# Altium schematic sheet esp-plane-s.SchDoc
size A4; SheetNumber: 1; SheetTotal: 1; SPICEModelCacheZWEIZCEH: <root> / <DocumentId>ZWEIZCEH</DocumentId> / <CacheFrame Number="0"> / <Model Name="skydiode" Kind="MDL"> / <Text>*Default Schottky Diode / *Schottky Diode Pinout: A,K / .MODEL SKYDIODE D(EG=0.69 XTI=2)</Text> / </Model> / </CacheFrame> / </root>
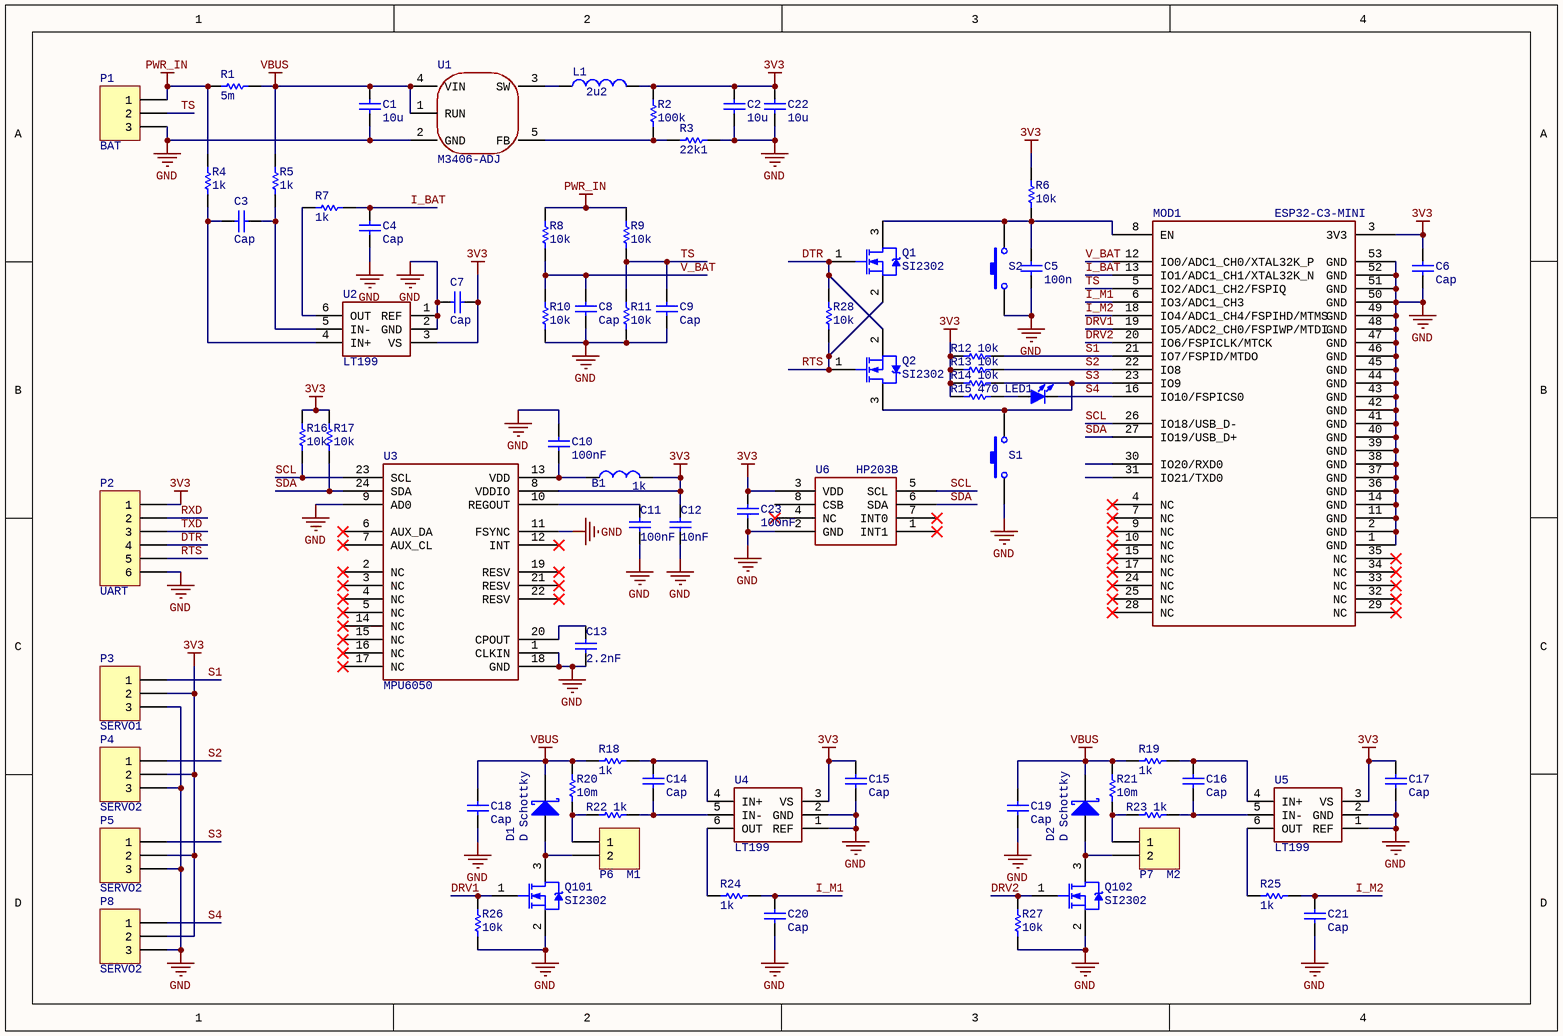
[diagram p0: esp-plane-s.SchDoc]

## Parts
B1  value 1k  [RESC100X50X35L25N]  (hidden comment: BEAD-470-100MHZ-1A-0603-BLM18PG471SN1)
C1  value 10u  [CAPC160X80X90L30N]  (hidden comment: Capacitor)
C2  value 10u  [CAPC160X80X90L30N]  (hidden comment: Capacitor)
C3  Cap  [CAPC100X50X55L25N]
C4  Cap  [CAPC100X50X55L25N]
C5  value 100n  [CAPC100X50X55L25N]  (hidden comment: Capacitor)
C6  Cap  [CAPC100X50X55L25N]
C7  Cap  [CAPC100X50X55L25N]
C8  Cap  [CAPC100X50X55L25N]
C9  Cap  [CAPC100X50X55L25N]
C10  100nF  [CAPC100X50X55L25N]
C11  100nF  [CAPC100X50X55L25N]
C12  10nF  [CAPC100X50X55L25N]
C13  2.2nF  [CAPC100X50X55L25N]
C14  Cap  [CAPC100X50X55L25N]
C15  Cap  [CAPC100X50X55L25N]
C16  Cap  [CAPC100X50X55L25N]
C17  Cap  [CAPC100X50X55L25N]
C18  Cap  [CAPC160X80X90L30N]
C19  Cap  [CAPC160X80X90L30N]
C20  Cap  [CAPC100X50X55L25N]
C21  Cap  [CAPC100X50X55L25N]
C22  value 10u  [CAPC160X80X90L30N]  (hidden comment: Capacitor)
C23  100nF  [CAPC100X50X55L25N]
D1  D Schottky  [SOD-523]
D2  D Schottky  [SOD-523]
L1  value 2u2  [INDC200X160X105L60N]  (hidden comment: Inductor)
LED1  蓝灯 正贴  [LEDC100X50X45L25N]  (value not drawn)
MOD1  ESP32-C3-MINI  [ESP32-C3-MINI-1U]
P1  BAT  [BC-1-319]
P2  UART  [HDR1X6]
P3  SERVO1  [FPC-SMD_3P-P1.25_DEALON_1.25-3PS-1]
P4  SERVO2  [FPC-SMD_3P-P1.25_DEALON_1.25-3PS-1]
P5  SERVO2  [FPC-SMD_3P-P1.25_DEALON_1.25-3PS-1]
P6  M1  [CONN-SMD_2P-P1.25_DEALON_1.25-2PS]
P7  M2  [CONN-SMD_2P-P1.25_DEALON_1.25-2PS]
P8  SERVO2  [FPC-SMD_3P-P1.25_DEALON_1.25-3PS-1]
Q1  SI2302  [SOT23-3P95_237X111L52X43N]
Q2  SI2302  [SOT23-3P95_237X111L52X43N]
Q101  SI2302  [SOT23-3P95_237X111L52X43N]
Q102  SI2302  [SOT23-3P95_237X111L52X43N]
R1  5m  [RES 0603/1608]
R2  value 100k  [RESC100X50X35L25N]  (hidden comment: Resistor)
R3  value 22k1  [RESC100X50X35L25N]  (hidden comment: Resistor)
R4  1k  [RESC100X50X35L25N]
R5  1k  [RESC100X50X35L25N]
R6  value 10k  [RESC100X50X35L25N]  (hidden comment: Resistor)
R7  1k  [RESC100X50X35L25N]
R8  10k  [RESC100X50X35L25N]
R9  10k  [RESC100X50X35L25N]
R10  10k  [RESC100X50X35L25N]
R11  10k  [RESC100X50X35L25N]
R12  value 10k  [RESC100X50X35L25N]  (hidden comment: Resistor)
R13  value 10k  [RESC100X50X35L25N]  (hidden comment: Resistor)
R14  value 10k  [RESC100X50X35L25N]  (hidden comment: Resistor)
R15  value 470  [RESC100X50X35L25N]  (hidden comment: Resistor)
R16  10k  [RESC100X50X35L25N]
R17  10k  [RESC100X50X35L25N]
R18  1k  [RESC100X50X35L25N]
R19  1k  [RESC100X50X35L25N]
R20  10m  [RES 0603/1608]
R21  10m  [RES 0603/1608]
R22  1k  [RESC100X50X35L25N]
R23  1k  [RESC100X50X35L25N]
R24  1k  [RESC100X50X35L25N]
R25  1k  [RESC100X50X35L25N]
R26  10k  [RESC100X50X35L25N]
R27  10k  [RESC100X50X35L25N]
R28  value 10k  [RESC100X50X35L25N]  (hidden comment: Resistor)
S1  KEY  [KEY-3*4]  (value not drawn)
S2  KEY  [KEY-3*4]  (value not drawn)
U1  M3406-ADJ  [SOT23-5P95_280X110L37X40N]
U2  LT199  [SC-70-6_L2.0-W1.3-P0.65-LS2.2-BL]
U3  MPU6050  [IMU-3000]
U4  LT199  [SC-70-6_L2.0-W1.3-P0.65-LS2.2-BL]
U5  LT199  [SC-70-6_L2.0-W1.3-P0.65-LS2.2-BL]
U6  HP203B  [HP203B]

## Nets
3V3: B1.2 C2.2 C6.2 C7.1 C12.1 C15.2 C17.2 C22.2 C23.1 L1.2 MOD1.3(3V3) P2.1 P3.2 P4.2 P5.2 P8.2 R2.2 R6.2 R12.1 R13.1 R14.1 R15.1 R16.2 R17.2 U2.3(VS) U3.8(VDDIO) U4.3(VS) U5.3(VS) U6.3(VDD)
GND: C1.1 C2.1 C4.1 C5.1 C6.1 C7.2 C8.2 C9.2 C10.1 C11.1 C12.2 C13.1 C15.1 C17.1 C18.1 C19.1 C20.1 C21.1 C22.1 C23.2 MOD1.1(GND) MOD1.2(GND) MOD1.11(GND) MOD1.14(GND) MOD1.36(GND) MOD1.37(GND) MOD1.38(GND) MOD1.39(GND) MOD1.40(GND) MOD1.41(GND) MOD1.42(GND) MOD1.43(GND) MOD1.44(GND) MOD1.45(GND) MOD1.46(GND) MOD1.47(GND) MOD1.48(GND) MOD1.49(GND) MOD1.50(GND) MOD1.51(GND) MOD1.52(GND) MOD1.53(GND) P1.3 P2.6 P3.3 P4.3 P5.3 P8.3 Q101.2(S) Q102.2(S) R3.1 R10.1 R11.1 R26.1 R27.1 S1.2 S2.2 U1.2(GND) U2.1(REF) U2.2(GND) U3.1(CLKIN) U3.9(AD0) U3.11(FSYNC) U3.18(GND) U4.1(REF) U4.2(GND) U5.1(REF) U5.2(GND) U6.2(GND)
PWR_IN: P1.1 R1.2 R4.1 R8.2 R9.2
VBUS: C1.2 C18.2 C19.2 D1.2(K) D2.2(K) R1.1 R5.1 R18.1 R19.1 R20.2 R21.2 U1.1(RUN) U1.4(VIN)
DRV1: MOD1.19(IO5/ADC2_CH0/FSPIWP/MTDI) Q101.1(G) R26.2
DRV2: MOD1.20(IO6/FSPICLK/MTCK) Q102.1(G) R27.2
DTR: P2.4 Q1.1(G) Q2.2(S) R28.2
I_BAT: C4.2 MOD1.13(IO1/ADC1_CH1/XTAL32K_N) R7.2
I_M1: C20.2 MOD1.6(IO3/ADC1_CH3) R24.2
I_M2: C21.2 MOD1.18(IO4/ADC1_CH4/FSPIHD/MTMS) R25.2
RTS: P2.5 Q1.2(S) Q2.1(G) R28.1
RXD: P2.2
S1: MOD1.21(IO7/FSPID/MTDO) P3.1 R12.2
S2: MOD1.22(IO8) P4.1 R13.2
S3: MOD1.23(IO9) P5.1 Q2.3(D) R14.2 S1.1
S4: LED1.C(K) MOD1.16(IO10/FSPICS0) P8.1
SCL: MOD1.26(IO18/USB_D-) R16.1 U3.23(SCL) U6.5(SCL)
SDA: MOD1.27(IO19/USB_D+) R17.1 U3.24(SDA) U6.6(SDA)
TS: C9.1 MOD1.5(IO2/ADC1_CH2/FSPIQ) P1.2 R9.1 R11.2
TXD: P2.3
V_BAT: C8.1 MOD1.12(IO0/ADC1_CH0/XTAL32K_P) R8.1 R10.2
NetB1_1: B1.1 C10.2 U3.13(VDD)
NetC3_1: C3.1 R4.2 U2.4(IN+)
NetC3_2: C3.2 R5.2 U2.5(IN-)
NetC5_2: C5.2 MOD1.8(EN) Q1.3(D) R6.1 S2.1
NetC11_2: C11.2 U3.10(REGOUT)
NetC13_2: C13.2 U3.20(CPOUT)
NetC14_1: C14.1 R22.2 U4.5(IN-)
NetC14_2: C14.2 R18.2 U4.4(IN+)
NetC16_1: C16.1 R23.2 U5.5(IN-)
NetC16_2: C16.2 R19.2 U5.4(IN+)
NetD1_1: D1.1(A) P6.2 Q101.3(D)
NetD2_1: D2.1(A) P7.2 Q102.3(D)
NetL1_1: L1.1 U1.3(SW)
NetLED1_A: LED1.A R15.2
NetP6_1: P6.1 R20.1 R22.1
NetP7_1: P7.1 R21.1 R23.1
NetR2_1: R2.1 R3.2 U1.5(FB)
NetR7_1: R7.1 U2.6(OUT)
NetR24_1: R24.1 U4.6(OUT)
NetR25_1: R25.1 U5.6(OUT)

Not connected (* = marked no-connect by the designer): MOD1 4(NC)* 7(NC)* 9(NC)* 10(NC)* 15(NC)* 17(NC)* 24(NC)* 25(NC)* 28(NC)* 29(NC)* 30(IO20/RXD0) 31(IO21/TXD0) 32(NC)* 33(NC)* 34(NC)* 35(NC)*; U3 2(NC)* 3(NC)* 4(NC)* 5(NC)* 6(AUX_DA)* 7(AUX_CL)* 12(INT)* 14(NC)* 15(NC)* 16(NC)* 17(NC)* 19(RESV)* 21(RESV)* 22(RESV)*; U6 1(INT1)* 4(NC)* 7(INT0)* 8(CSB)

## Library data of the parts
B1 = BEAD-470-100MHZ-1A-0603-BLM18PG471SN1: DCR 0.03,2A  0603; PART_NUMBER: TY01401021; MANUFACTURER_PART_NUMBER: PZ1608U600; MANUFACTURER: 顺络电子; 制造商: Murata; 物料描述: 贴片磁珠 470ohm@100M,1000mA, 0.2ohm, 0603; Geometry.Height: 0.6mm; SOURCE_PATH: D:\BOM_DATABASE\ORCAD_SCH_LIBRARY1.OLB; PCB DECAL: L0603; 规格型号: BLM18PG471SN1
C1 C2 C5 C22 = GRM188R61E106KA73D: MPN: TCC0603X5R106K100CT; Manufacturer: CCTC(三环); 编号: C380314; Case/Package: 0603; Mounting Type: SMD
C3 C4 C6-C9 C14-C21 = Cap: Capacitor; Value: 100pF; Published: 8-Jun-2000; LatestRevisionDate: 17-Jul-2002; LatestRevisionNote: Re-released for DXP Platform.; PackageReference: RAD-0.3; Publisher: Altium Limited; PackageDescription: Radial Cap, Thru-Hole; 2 Leads; 0.3 in Pin Spacing
C10-C13 C23 = Cap Semi: Capacitor (Semiconductor SIM Model); Published: 8-Jun-2000; LatestRevisionDate: 29-May-2009; LatestRevisionNote: IPC-7351 Footprint Added.; PackageReference: C1206; Publisher: Altium Limited; PackageDescription: Chip Capacitor
  C10 C11 C23: Value: 100nF
  C12: Value: 10nF
  C13: Value: 2.2nF
D1 D2 = D Schottky: Schottky Diode; Published: 8-Jun-2000; LatestRevisionDate: 17-Jul-2002; LatestRevisionNote: Re-released for DXP Platform.; PackageReference: SMB; Publisher: Altium Limited; PackageDescription: DO-214-AA/SMB; 2 C-Bend Leads; Body 5.3 x 3.6 mm, inc. leads (LxW); Code_JEDEC: DO-214-AA
L1 = WPN201610U2R2MTY01: MPN: SFE201610-2R2M; Manufacturer: DDY(德立); 编号: C5159659; Case/Package: 201610; Mounting Type: SMD
LED1 = LED-SMD: 贴片LED; 编号: C965795
P1 P3-P5 P8 = Header 3: Header, 3-Pin; LatestRevisionDate: 17-Jul-2002; LatestRevisionNote: Re-released for DXP Platform.; Publisher: Altium Limited
P2 = Header 6: Header, 6-Pin; LatestRevisionDate: 17-Jul-2002; LatestRevisionNote: Re-released for DXP Platform.; Publisher: Altium Limited
P6 P7 = Header 2: Header, 2-Pin; LatestRevisionDate: 17-Jul-2002; LatestRevisionNote: Re-released for DXP Platform.; Publisher: Altium Limited
Q1 Q2 Q101 Q102 = NMOS-2: N-Channel Power MOSFET; Note: Pin 2 is electrically connected to pin 4.; Published: 8-Jun-2000; LatestRevisionDate: 17-Jul-2002; LatestRevisionNote: Re-released for DXP Platform.; DatasheetVersion: PD-9.814; PackageVersion: Feb-1997; PackageReference: TO-220AB; Publisher: Altium Limited; PackageDescription: TO, Thru-Hole, Vertical, Heatsink Mounted; 3 In-Line Leads; Pitch 2.54 mm; ComponentLink1Description: Manufacturer Link; ComponentLink1URL: http://www.irf.com/
R1 R4 R5 R7-R11 R18-R27 = Res1: Resistor; Published: 8-Jun-2000; LatestRevisionDate: 17-Jul-2002; LatestRevisionNote: Re-released for DXP Platform.; PackageReference: AXIAL-0.3; Publisher: Altium Limited; PackageDescription: Axial Device, Thru-Hole; 2 Leads; 0.3 in Pin Spacing
  R1: Value: 5m
  R4 R5 R7 R18 R19 R22-R25: Value: 1k
  R8-R11 R26 R27: Value: 10k
  R20 R21: Value: 10m
R2 = RC0402FR-07100KL: MPN: RTT021003FTH; Manufacturer: RALEC(旺诠); 编号: C102750; Case/Package: 0402; Mounting Type: SMD
R3 R6 = RC0402FR-0722K1L: MPN: RTT022212FTH; Manufacturer: RALEC(旺诠); 编号: C102896; Case/Package: 0402; Mounting Type: SMD
R12-R15 R28 = RC0402FR-07100KL: MPN: RTT02471JTH; Manufacturer: RALEC(旺诠); 编号: C103058; Case/Package: 0402; Mounting Type: SMD
R16 R17 = RC0402JR-074K7L: RES SMD 4.7K OHM 5% 1/16W 0402; Manufacturer: Yageo; Value: 10k; Part Number: RC0402JR-074K7L; Supplier 1: Digi-Key; Supplier Part Number 1: 311-4.7KJRCT-ND
S1 S2 = SW-PB: Switch; Published: 24-Mar-1999; Revision: July-2002: Re-released for DXP Platform.; Publisher: Altium Limited
U1 = M3406-ADJ: Vin=2V~6V,800mA,DCDC; Manufacturer: 西安航天民芯; 编号: C83224; MPN: M3406-ADJ; Mounting Type: SMD
U2 U4 U5 = LT199_SC70-6L